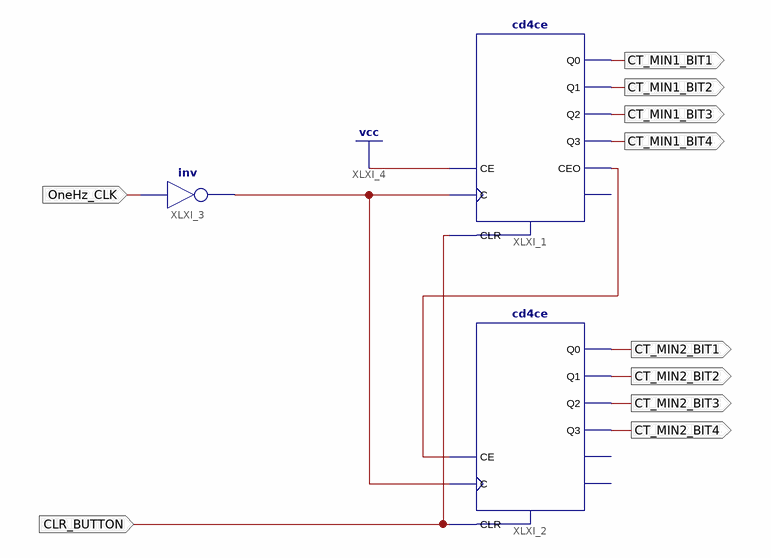
[diagram p0: schematic sheet 1]
// Xilinx ISE schematic Counter_Min.sch (spartan6) as structural Verilog: 3 symbols, 10 ports
module Counter_Min (
  input  OneHz_CLK,
  input  CLR_BUTTON,
  output CT_MIN2_BIT1,
  output CT_MIN2_BIT2,
  output CT_MIN2_BIT3,
  output CT_MIN2_BIT4,
  output CT_MIN1_BIT1,
  output CT_MIN1_BIT2,
  output CT_MIN1_BIT3,
  output CT_MIN1_BIT4
);

  wire XLXN_2, XLXN_18;

  cd4ce XLXI_1 (
    .C(XLXN_18), .CE(1'b1), .CLR(CLR_BUTTON), .CEO(XLXN_2), .Q0(CT_MIN1_BIT1), .Q1(CT_MIN1_BIT2),
    .Q2(CT_MIN1_BIT3), .Q3(CT_MIN1_BIT4));  // open: TC
  cd4ce XLXI_2 (
    .C(XLXN_18), .CE(XLXN_2), .CLR(CLR_BUTTON), .Q0(CT_MIN2_BIT1), .Q1(CT_MIN2_BIT2), .Q2(CT_MIN2_BIT3),
    .Q3(CT_MIN2_BIT4));  // open: CEO, TC
  not XLXI_3 (XLXN_18, OneHz_CLK);
endmodule
